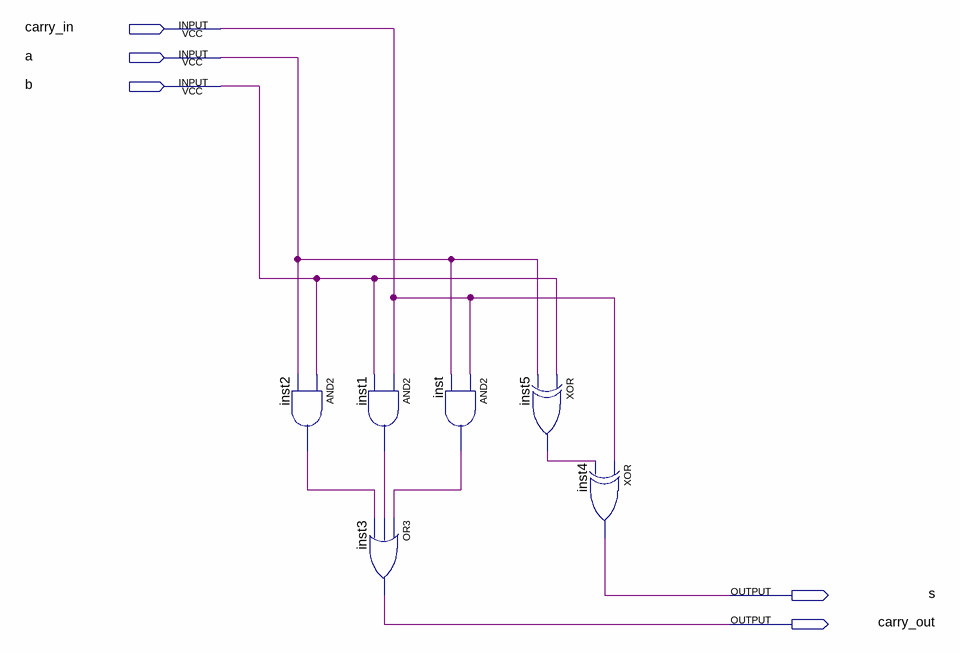
[diagram p0: schematic sheet]
// Quartus schematic qjq.bdf as structural Verilog: 6 symbols, 5 pins
module qjq (
  input  carry_in,
  input  a,
  input  b,
  output s,
  output carry_out
);

  wire inst1_out, inst2_out, inst5_out, inst_out;

  and inst2 (inst2_out, b, a);
  and inst1 (inst1_out, carry_in, b);
  or inst3 (carry_out, inst_out, inst1_out, inst2_out);
  and inst (inst_out, carry_in, a);
  xor inst5 (inst5_out, b, a);
  xor inst4 (s, carry_in, inst5_out);
endmodule
